# Altium schematic sheet [06] - RAM DDR2.SchDoc
size A4; DocumentNumber: 6; SheetNumber: 6; SheetTotal: 9
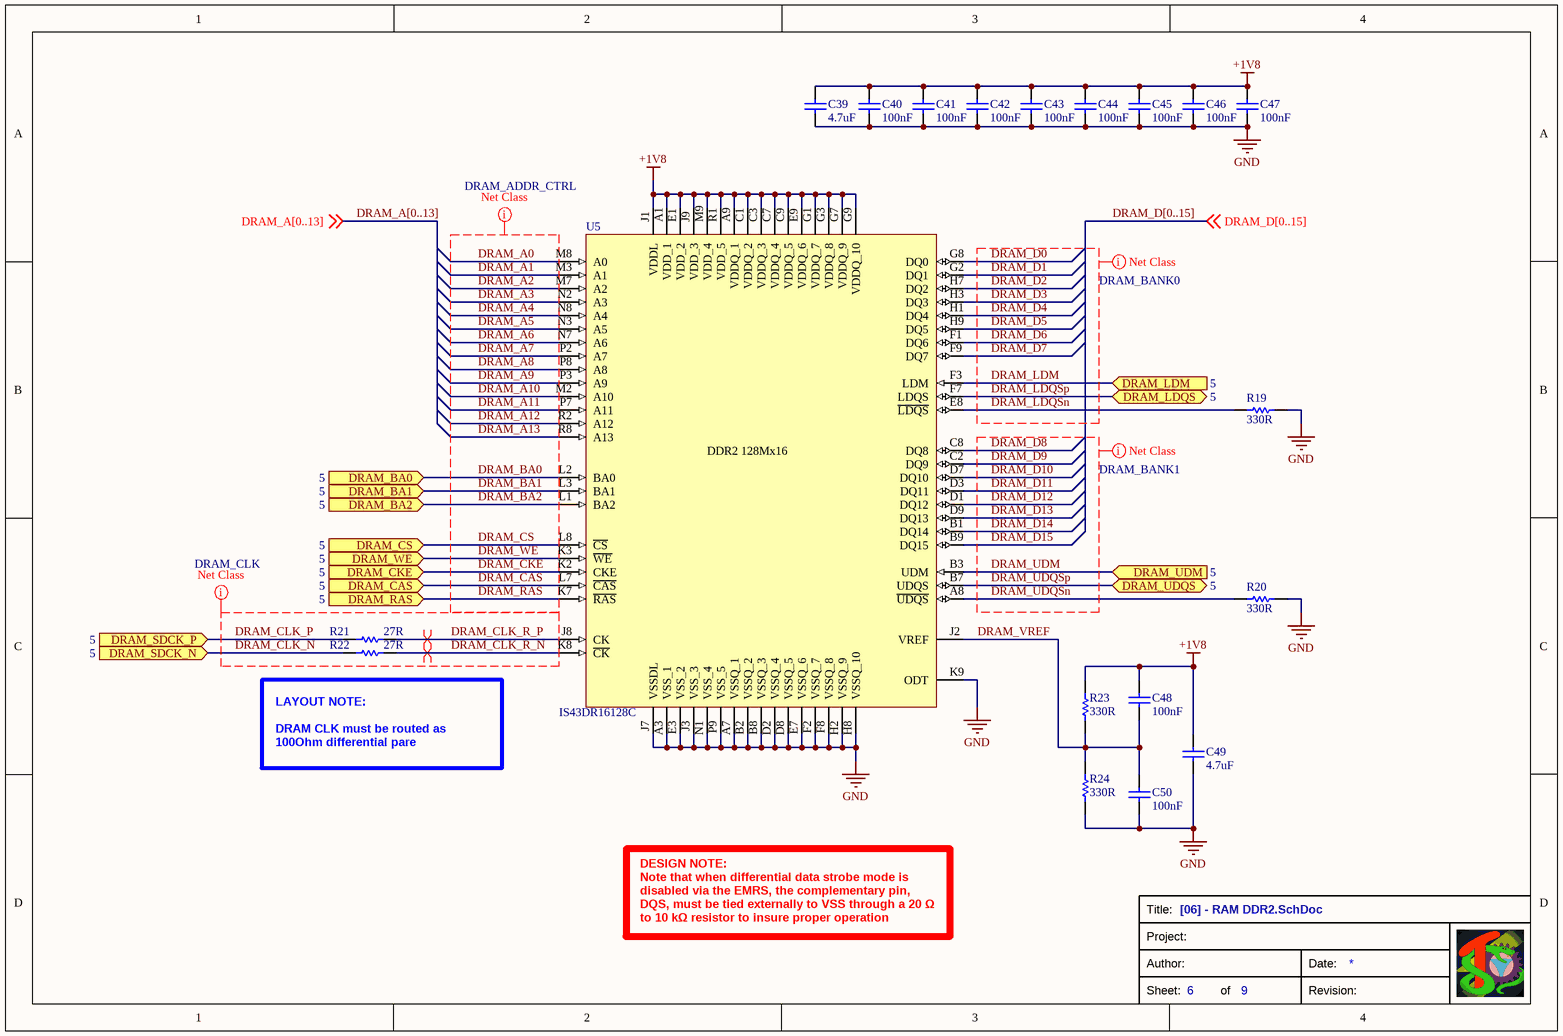
[diagram p0: [06] - RAM DDR2.SchDoc]

## Parts
C39  value 4.7uF  [CAP-0805]  (hidden comment: 885012107013)
C40  value 100nF  [CAP-0603]  (hidden comment: C0603C104M4RAC)
C41  value 100nF  [CAP-0603]  (hidden comment: C0603C104M4RAC)
C42  value 100nF  [CAP-0603]  (hidden comment: C0603C104M4RAC)
C43  value 100nF  [CAP-0603]  (hidden comment: C0603C104M4RAC)
C44  value 100nF  [CAP-0603]  (hidden comment: C0603C104M4RAC)
C45  value 100nF  [CAP-0603]  (hidden comment: C0603C104M4RAC)
C46  value 100nF  [CAP-0603]  (hidden comment: C0603C104M4RAC)
C47  value 100nF  [CAP-0603]  (hidden comment: C0603C104M4RAC)
C48  value 100nF  [CAP-0603]  (hidden comment: C0603C104M4RAC)
C49  value 4.7uF  [CAP-0805]  (hidden comment: 885012107013)
C50  value 100nF  [CAP-0603]  (hidden comment: C0603C104M4RAC)
R19  value 330R  [RES-0603]  (hidden comment: RT0603FRD07330RL)
R20  value 330R  [RES-0603]  (hidden comment: RT0603FRD07330RL)
R21  value 27R  [RES-0603]  (hidden comment: RT0603DRD0727RL)
R22  value 27R  [RES-0603]  (hidden comment: RT0603DRD0727RL)
R23  value 330R  [RES-0603]  (hidden comment: RT0603FRD07330RL)
R24  value 330R  [RES-0603]  (hidden comment: RT0603FRD07330RL)
U5  IS43DR16128C  [BGA0.8_DDR2_86_9X12.5]

## Ports
DRAM_BA0 (in, see 5), DRAM_BA1 (in, see 5), DRAM_BA2 (in, see 5), DRAM_CAS (in, see 5), DRAM_CKE (in, see 5), DRAM_CS (in, see 5), DRAM_LDM (in, see 5), DRAM_LDQS (bidir, see 5), DRAM_RAS (in, see 5), DRAM_SDCK_N (in, see 5), DRAM_SDCK_P (in, see 5), DRAM_UDM (in, see 5), DRAM_UDQS (bidir, see 5), DRAM_WE (in, see 5)

## Nets
+1V8: C39.2 C40.2 C41.2 C42.2 C43.2 C44.2 C45.2 C46.2 C47.2 C48.2 C49.2 R23.2 U5.A1(VDD_1) U5.A9(VDDQ_1) U5.C1(VDDQ_2) U5.C3(VDDQ_3) U5.C7(VDDQ_4) U5.C9(VDDQ_5) U5.E1(VDD_2) U5.E9(VDDQ_6) U5.G1(VDDQ_7) U5.G3(VDDQ_8) U5.G7(VDDQ_9) U5.G9(VDDQ_10) U5.J1(VDDL) U5.J9(VDD_3) U5.M9(VDD_4) U5.R1(VDD_5)
GND: C39.1 C40.1 C41.1 C42.1 C43.1 C44.1 C45.1 C46.1 C47.1 C49.1 C50.1 R19.1 R20.1 R24.1 U5.A3(VSS_1) U5.A7(VSSQ_1) U5.B2(VSSQ_2) U5.B8(VSSQ_3) U5.D2(VSSQ_4) U5.D8(VSSQ_5) U5.E3(VSS_2) U5.E7(VSSQ_6) U5.F2(VSSQ_7) U5.F8(VSSQ_8) U5.H2(VSSQ_9) U5.H8(VSSQ_10) U5.J3(VSS_3) U5.J7(VSSDL) U5.K9(ODT) U5.N1(VSS_4) U5.P9(VSS_5)
DRAM_A0: U5.M8(A0)
DRAM_A1: U5.M3(A1)
DRAM_A2: U5.M7(A2)
DRAM_A3: U5.N2(A3)
DRAM_A4: U5.N8(A4)
DRAM_A5: U5.N3(A5)
DRAM_A6: U5.N7(A6)
DRAM_A7: U5.P2(A7)
DRAM_A8: U5.P8(A8)
DRAM_A9: U5.P3(A9)
DRAM_A10: U5.M2(A10)
DRAM_A11: U5.P7(A11)
DRAM_A12: U5.R2(A12)
DRAM_A13: U5.R8(A13)
DRAM_BA0: U5.L2(BA0) ; port DRAM_BA0
DRAM_BA1: U5.L3(BA1) ; port DRAM_BA1
DRAM_BA2: U5.L1(BA2) ; port DRAM_BA2
DRAM_CAS: U5.L7(~{CAS}) ; port DRAM_CAS
DRAM_CKE: U5.K2(CKE) ; port DRAM_CKE
DRAM_CLK_N: R22.1 ; port DRAM_SDCK_N
DRAM_CLK_P: R21.1 ; port DRAM_SDCK_P
DRAM_CLK_R_N: R22.2 U5.K8(~{CK})
DRAM_CLK_R_P: R21.2 U5.J8(CK)
DRAM_CS: U5.L8(~{CS}) ; port DRAM_CS
DRAM_D0: U5.G8(DQ0)
DRAM_D1: U5.G2(DQ1)
DRAM_D2: U5.H7(DQ2)
DRAM_D3: U5.H3(DQ3)
DRAM_D4: U5.H1(DQ4)
DRAM_D5: U5.H9(DQ5)
DRAM_D6: U5.F1(DQ6)
DRAM_D7: U5.F9(DQ7)
DRAM_D8: U5.C8(DQ8)
DRAM_D9: U5.C2(DQ9)
DRAM_D10: U5.D7(DQ10)
DRAM_D11: U5.D3(DQ11)
DRAM_D12: U5.D1(DQ12)
DRAM_D13: U5.D9(DQ13)
DRAM_D14: U5.B1(DQ14)
DRAM_D15: U5.B9(DQ15)
DRAM_LDM: U5.F3(LDM) ; port DRAM_LDM
DRAM_LDQSn: R19.2 U5.E8(~{LDQS})
DRAM_LDQSp: U5.F7(LDQS) ; port DRAM_LDQS
DRAM_RAS: U5.K7(~{RAS}) ; port DRAM_RAS
DRAM_UDM: U5.B3(UDM) ; port DRAM_UDM
DRAM_UDQSn: R20.2 U5.A8(~{UDQS})
DRAM_UDQSp: U5.B7(UDQS) ; port DRAM_UDQS
DRAM_VREF: C48.1 C50.2 R23.1 R24.2 U5.J2(VREF)
DRAM_WE: U5.K3(~{WE}) ; port DRAM_WE

## Buses and harness runs
bus DRAM_A[0..13]
bus DRAM_D[0..15]

## Layout directives
net class DRAM_BANK0: DRAM_D0, DRAM_D1, DRAM_D2, DRAM_D3, DRAM_D4, DRAM_D5, DRAM_D6, DRAM_D7, DRAM_LDM, DRAM_LDQSn, DRAM_LDQSp
net class DRAM_BANK1: DRAM_D8, DRAM_D9, DRAM_D10, DRAM_D11, DRAM_D12, DRAM_D13, DRAM_D14, DRAM_D15, DRAM_UDM, DRAM_UDQSn, DRAM_UDQSp
net class DRAM_CLK: DRAM_CLK_N, DRAM_CLK_P, DRAM_CLK_R_N, DRAM_CLK_R_P
net class DRAM_ADDR_CTRL: DRAM_A0, DRAM_A1, DRAM_A2, DRAM_A3, DRAM_A4, DRAM_A5, DRAM_A6, DRAM_A7, DRAM_A8, DRAM_A9, DRAM_A10, DRAM_A11, DRAM_A12, DRAM_A13, DRAM_BA0, DRAM_BA1, DRAM_BA2, DRAM_CAS, DRAM_CKE, DRAM_CS, DRAM_RAS, DRAM_WE
differential pair; differential pair class DIFF100: DRAM_CLK_R_N, DRAM_CLK_R_P

## Notes on the sheet
- LAYOUT NOTE:
  DRAM CLK must be routed as 100Ohm differential pare
- DESIGN NOTE:
  Note that when differential data strobe mode is disabled via the EMRS, the complementary pin, DQS, must be tied externally to VSS through a 20 Ω to 10 kΩ resistor to insure proper operation
- Title:
- Project:
- Sheet:
- Author:
- of
- Revision:
- Date:
- (in symbol ISSI-DDR2-IS43DR16128C) DDR2 128Mx16

## Library data of the parts
C39 C49 = CAP-0805-4.7u-885012107013_2: Multilayer Ceramic Capacitors MLCC - SMD/SMT WCAP-CSGP 4.7uF 0805 20% 16V MLCC; Manufacturer: Wurth Elektronik; Voltage Rating DC: 16 VDC; Supplier 1: Mouser; Supplier Part Number 1: 710-885012107013
C40-C48 C50 = CAP-0603-100n-C0603C104M4RAC: Multilayer Ceramic Capacitors MLCC - SMD/SMT 16V 0.1uF X7R 0603 20%; Manufacturer: KEMET; Voltage Rating DC: 16 VDC; Supplier 1: Mouser; Supplier Part Number 1: 80-C0603C104M4RAC
R19 R20 R23 R24 = RES-0603-330R-RT0603FRD07330RL: Thin Film Resistors - SMD 1/10W 330 ohm 1% 50ppm; Manufacturer: Yageo; Supplier 1: Mouser; Supplier Part Number 1: 603-RT0603FRD07330RL
R21 R22 = RES-0603-27R-RT0603DRD0727RL: Thin Film Resistors - SMD 1/10W 27 ohm 1% 50ppm; Manufacturer: Yageo; Supplier 1: Mouser; Supplier Part Number 1: 603-RT0603DRD0727RL
U5 = ISSI-DDR2-IS43DR16128C: 256Mx8, 128Mx16 DDR2 DRAM; Supplier 1: Mouser; Supplier Part Number 1: 870-3DR16128C-25DBLI